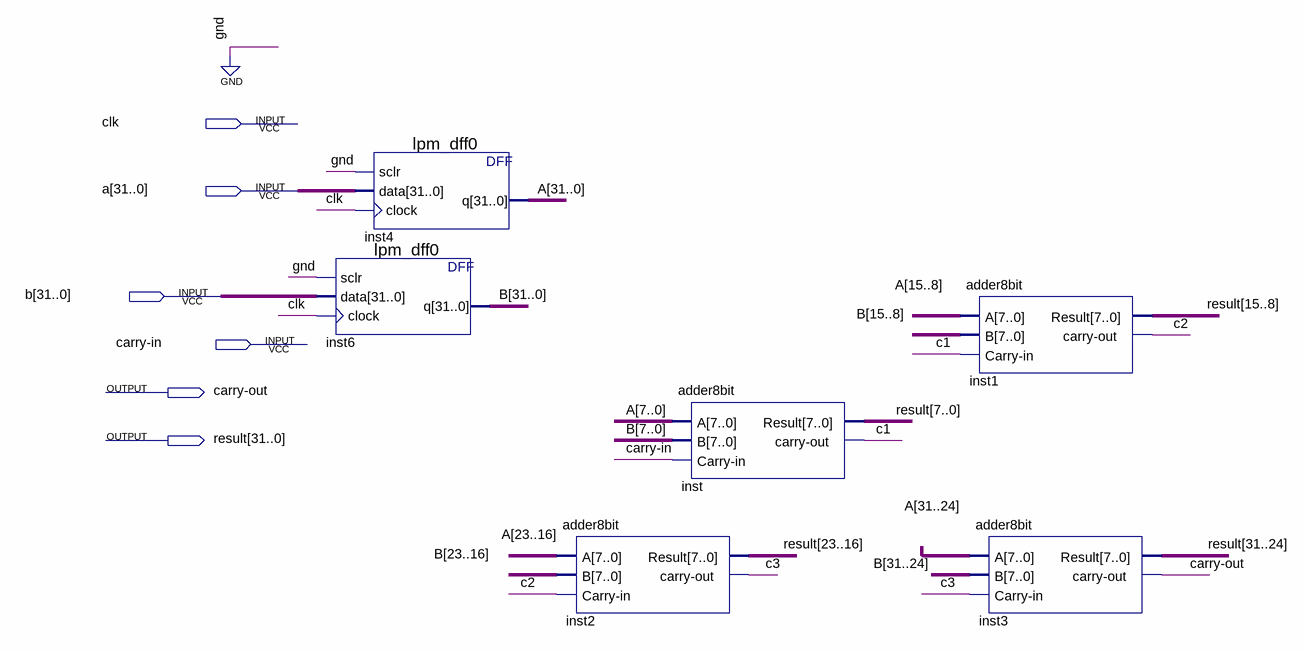
[diagram p0: schematic sheet]
// Quartus schematic adder-32bit.bdf as structural Verilog: 6 symbols, 6 pins
module \adder-32bit  (
  input  clk,
  input  [31:0] a,
  input  [31:0] b,
  input  \carry-in ,
  output \carry-out ,
  output [31:0] result
);

  wire c1, c2, c3;

  lpm_dff0 inst4 (.sclr(1'b0), .data(a), .clock(clk), .q(a));
  lpm_dff0 inst6 (.sclr(1'b0), .data(b), .clock(clk), .q(b));
  adder8bit inst2 (.A(a[23:16]), .B(b[23:16]), .\Carry-in (c2), .Result(result[23:16]), .\carry-out (c3));
  adder8bit inst (.A(a[7:0]), .B(b[7:0]), .\Carry-in (\carry-in ), .Result(result[7:0]), .\carry-out (c1));
  adder8bit inst1 (.A(a[15:8]), .B(b[15:8]), .\Carry-in (c1), .Result(result[15:8]), .\carry-out (c2));
  adder8bit inst3 (.A(a[31:24]), .B(b[31:24]), .\Carry-in (c3), .Result(result[31:24]), .\carry-out (\carry-out ));
endmodule
